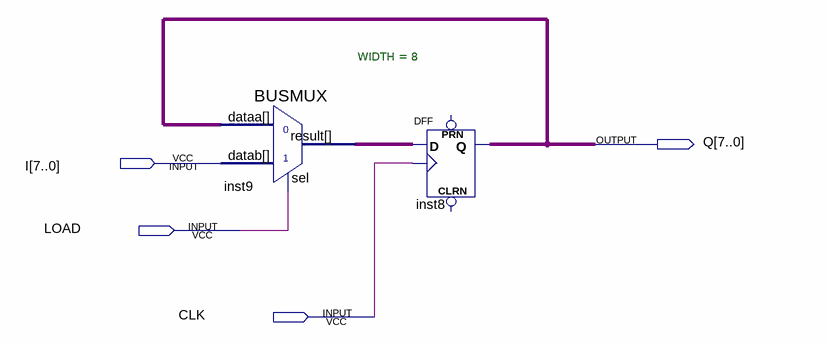
[diagram p0: schematic sheet]
// Quartus schematic REGISTER.bdf as structural Verilog: 2 symbols, 4 pins
module REGISTER (
  input  [7:0] I,
  input  LOAD,
  input  CLK,
  output [7:0] Q
);

  wire [7:0] inst9_result;

  BUSMUX #(.WIDTH(8)) inst9 (.datab(I), .sel(LOAD), .dataa(Q), .result(inst9_result));
  DFF inst8[7:0] (.CLK(CLK), .D(inst9_result), .Q(Q));  // open: CLRN, PRN
endmodule
